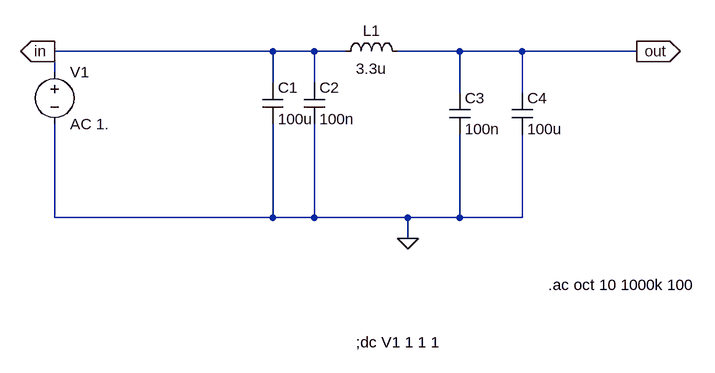
[diagram p0: schematic 5vlowpass.asc]
5vlowpass.asc, the LTspice schematic file:
Version 4
SHEET 1 1068 680
WIRE 400 128 64 128
WIRE 464 128 400 128
WIRE 512 128 464 128
WIRE 688 128 592 128
WIRE 784 128 688 128
WIRE 960 128 784 128
WIRE 64 160 64 128
WIRE 400 176 400 128
WIRE 464 176 464 128
WIRE 688 192 688 128
WIRE 784 192 784 128
WIRE 64 384 64 240
WIRE 400 384 400 240
WIRE 400 384 64 384
WIRE 464 384 464 240
WIRE 464 384 400 384
WIRE 608 384 464 384
WIRE 688 384 688 256
WIRE 688 384 608 384
WIRE 784 384 784 256
WIRE 784 384 688 384
WIRE 608 416 608 384
FLAG 608 416 0
FLAG 960 128 out
IOPIN 960 128 Out
FLAG 64 128 in
IOPIN 64 128 Out
SYMBOL voltage 64 144 R0
WINDOW 123 0 0 Left 0
WINDOW 39 0 0 Left 0
SYMATTR InstName V1
SYMATTR Value AC 1.
SYMBOL cap 384 176 R0
SYMATTR InstName C1
SYMATTR Value 100u
SYMBOL cap 448 176 R0
SYMATTR InstName C2
SYMATTR Value 100n
SYMBOL ind 496 144 R270
WINDOW 0 32 56 VTop 2
WINDOW 3 5 56 VBottom 2
SYMATTR InstName L1
SYMATTR Value 3.3u
SYMBOL cap 672 192 R0
SYMATTR InstName C3
SYMATTR Value 100n
SYMBOL cap 768 192 R0
SYMATTR InstName C4
SYMATTR Value 100u
TEXT 528 576 Left 2 !;dc V1 1 1 1
TEXT 824 488 Left 2 !.ac oct 10 1000k 100

The netlist it stands for:
* 5vlowpass.asc
V1 in 0 AC 1.
C1 in 0 100u
C2 in 0 100n
L1 in out 3.3u
C3 out 0 100n
C4 out 0 100u
;dc V1 1 1 1
.ac oct 10 1000k 100
.backanno
.end